# EAGLE schematic I2C_Shield (EAGLE 7.7.0)
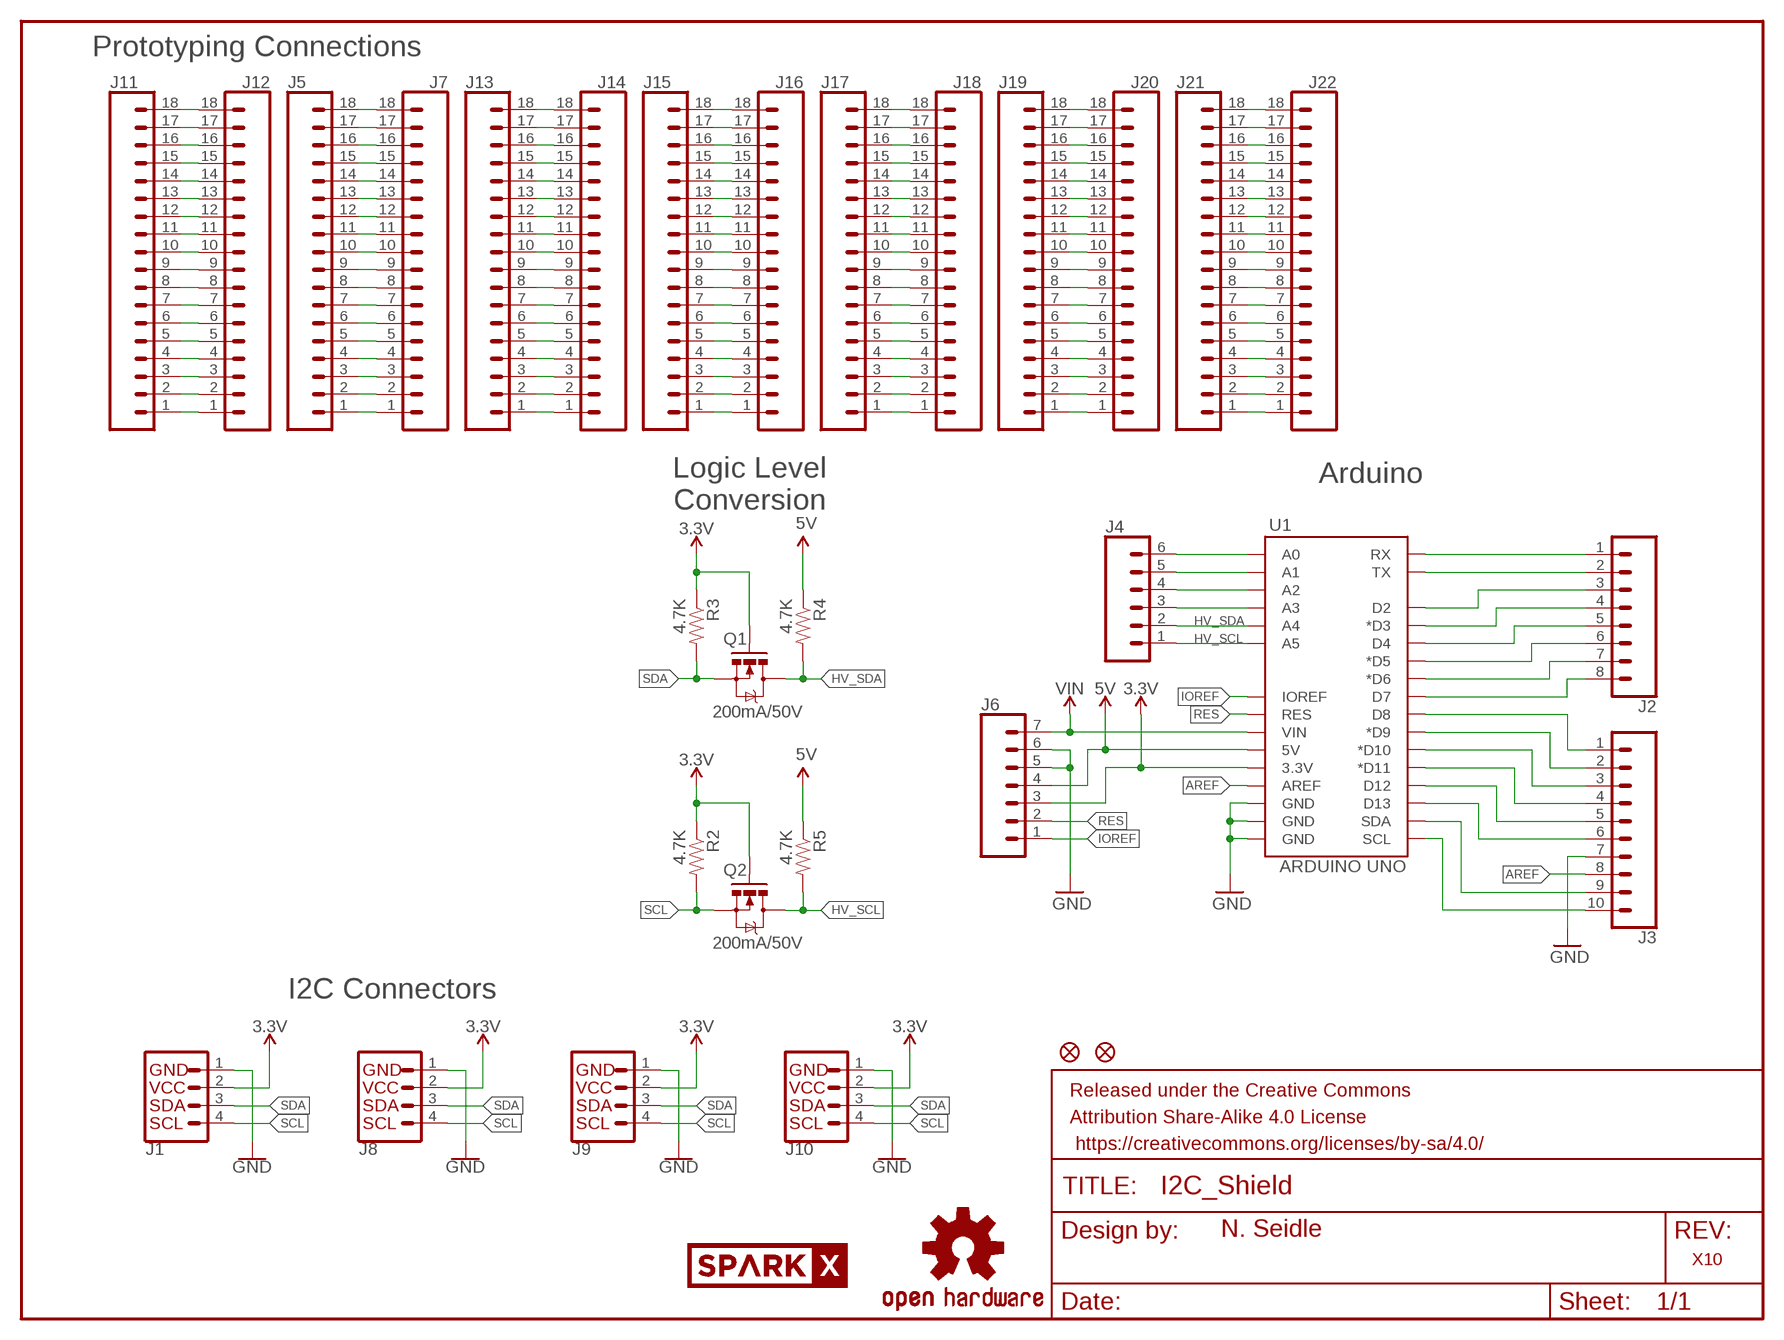
[diagram p0: schematic, sheet 1]

## Parts
FD1  FIDUCIAL1X2  [FIDUCIAL-1X2]
FD2  FIDUCIAL1X2  [FIDUCIAL-1X2]
FRAME1  FRAME-LETTER  [CREATIVE_COMMONS]
J1  I2C_STANDARDJS-1MM  [1X04_1MM_RA]
J2  CONN_08NO_SILK_FEMALE_PTH  [1X08_NO_SILK]
J3  CONN_10NO_SILK_PTH_FEMALE  [1X10_NO_SILK]
J4  CONN_06NO_SILK_FEMALE_PTH  [1X06_NO_SILK]
J5  CONN_18NO_SILK  [1X18_NO_SILK]
J6  CONN_07NO_SILK  [1X07_NO_SILK]
J7  CONN_18NO_SILK  [1X18_NO_SILK]
J8  I2C_STANDARDJS-1MM  [1X04_1MM_RA]
J9  I2C_STANDARDJS-1MM  [1X04_1MM_RA]
J10  I2C_STANDARDJS-1MM  [1X04_1MM_RA]
J11  CONN_18NO_SILK  [1X18_NO_SILK]
J12  CONN_18NO_SILK  [1X18_NO_SILK]
J13  CONN_18NO_SILK  [1X18_NO_SILK]
J14  CONN_18NO_SILK  [1X18_NO_SILK]
J15  CONN_18NO_SILK  [1X18_NO_SILK]
J16  CONN_18NO_SILK  [1X18_NO_SILK]
J17  CONN_18NO_SILK  [1X18_NO_SILK]
J18  CONN_18NO_SILK  [1X18_NO_SILK]
J19  CONN_18NO_SILK  [1X18_NO_SILK]
J20  CONN_18NO_SILK  [1X18_NO_SILK]
J21  CONN_18NO_SILK  [1X18_NO_SILK]
J22  CONN_18NO_SILK  [1X18_NO_SILK]
LOGO1  OSHW-LOGOMINI  [OSHW-LOGO-MINI]
Q1  200mA/50V  MOSFET-NCHANNELBSS138  [SOT23-3]
Q2  200mA/50V  MOSFET-NCHANNELBSS138  [SOT23-3]
R2  4.7K  4.7KOHM-1/10W-1%(0603)  [0603-RES]
R3  4.7K  4.7KOHM-1/10W-1%(0603)  [0603-RES]
R4  4.7K  4.7KOHM-1/10W-1%(0603)  [0603-RES]
R5  4.7K  4.7KOHM-1/10W-1%(0603)  [0603-RES]
U1  ARDUINO UNO  ARDUINO_R3_SHIELDNOLABELS  [UNO_R3_SHIELD_NOLABELS]
U$1  SPARKX-LOGO3  [SPARKX-SMALL]
U$2  SPARKX-LOGO5  [SPARKX-LARGE]

## Nets
3.3V: J1.2(VCC) J6.3 J8.2(VCC) J9.2(VCC) J10.2(VCC) Q1.1(G) Q2.1(G) R2.1 R3.1 U1.3.3V
5V: J6.4 R4.1 R5.1 U1.5V
A0: J4.6 U1.A0
A1: J4.5 U1.A1
A2: J4.4 U1.A2
A3: J4.3 U1.A3
AREF: J3.8 U1.AREF
D2: J2.3 U1.D2
D3: J2.4 U1.D3(*D3)
D4: J2.5 U1.D4
D5: J2.6 U1.D5(*D5)
D6: J2.7 U1.D6(*D6)
D7: J2.8 U1.D7
D8: J3.1 U1.D8
D9: J3.2 U1.D9(*D9)
D10: J3.3 U1.D10(*D10)
D11: J3.4 U1.D11(*D11)
D12: J3.5 U1.D12
D13: J3.6 U1.D13
GND [vcc]: J1.1(GND) J3.7 J6.5 J6.6 J8.1(GND) J9.1(GND) J10.1(GND) U1.GND@0(GND) U1.GND@1(GND) U1.GND@2(GND)
HV_SCL: J4.1 Q2.3(D) R5.2 U1.A5
HV_SDA: J4.2 Q1.3(D) R4.2 U1.A4
IOREF: J6.1 U1.IOREF
N$1: J5.2 J7.2
N$2: J5.3 J7.3
N$3: J5.4 J7.4
N$4: J5.5 J7.5
N$5: J5.6 J7.6
N$6: J5.7 J7.7
N$7: J5.8 J7.8
N$8: J5.9 J7.9
N$9: J5.10 J7.10
N$10: J5.11 J7.11
N$11: J5.12 J7.12
N$12: J5.13 J7.13
N$13: J5.14 J7.14
N$14: J5.15 J7.15
N$15: J5.16 J7.16
N$16: J5.17 J7.17
N$17: J5.18 J7.18
N$18: J5.1 J7.1
N$19: J13.2 J14.2
N$20: J13.3 J14.3
N$21: J11.2 J12.2
N$22: J11.3 J12.3
N$23: J11.4 J12.4
N$24: J11.5 J12.5
N$25: J11.6 J12.6
N$26: J11.7 J12.7
N$27: J11.8 J12.8
N$28: J11.9 J12.9
N$29: J11.10 J12.10
N$30: J11.11 J12.11
N$31: J11.12 J12.12
N$32: J11.13 J12.13
N$33: J11.14 J12.14
N$34: J11.15 J12.15
N$35: J11.16 J12.16
N$36: J11.17 J12.17
N$37: J11.18 J12.18
N$38: J11.1 J12.1
N$39: J13.4 J14.4
N$40: J13.5 J14.5
N$41: J13.6 J14.6
N$42: J13.7 J14.7
N$43: J13.8 J14.8
N$44: J13.9 J14.9
N$45: J13.10 J14.10
N$46: J13.11 J14.11
N$47: J13.12 J14.12
N$48: J13.13 J14.13
N$49: J13.14 J14.14
N$50: J13.15 J14.15
N$51: J13.16 J14.16
N$52: J13.17 J14.17
N$53: J13.18 J14.18
N$54: J13.1 J14.1
N$55: J15.2 J16.2
N$56: J15.3 J16.3
N$57: J15.4 J16.4
N$58: J15.5 J16.5
N$59: J15.6 J16.6
N$60: J15.7 J16.7
N$61: J15.8 J16.8
N$62: J15.9 J16.9
N$63: J15.10 J16.10
N$64: J15.11 J16.11
N$65: J15.12 J16.12
N$66: J15.13 J16.13
N$67: J15.14 J16.14
N$68: J15.15 J16.15
N$69: J15.16 J16.16
N$70: J15.17 J16.17
N$71: J15.18 J16.18
N$72: J15.1 J16.1
N$73: J17.2 J18.2
N$74: J17.3 J18.3
N$75: J17.4 J18.4
N$76: J17.5 J18.5
N$77: J17.6 J18.6
N$78: J17.7 J18.7
N$79: J17.8 J18.8
N$80: J17.9 J18.9
N$81: J17.10 J18.10
N$82: J17.11 J18.11
N$83: J17.12 J18.12
N$84: J17.13 J18.13
N$85: J17.14 J18.14
N$86: J17.15 J18.15
N$87: J17.16 J18.16
N$88: J17.17 J18.17
N$89: J17.18 J18.18
N$90: J17.1 J18.1
N$91: J19.2 J20.2
N$92: J19.3 J20.3
N$93: J19.4 J20.4
N$94: J19.5 J20.5
N$95: J19.6 J20.6
N$96: J19.7 J20.7
N$97: J19.8 J20.8
N$98: J19.9 J20.9
N$99: J19.10 J20.10
N$100: J19.11 J20.11
N$101: J19.12 J20.12
N$102: J19.13 J20.13
N$103: J19.14 J20.14
N$104: J19.15 J20.15
N$105: J19.16 J20.16
N$106: J19.17 J20.17
N$107: J19.18 J20.18
N$108: J19.1 J20.1
N$109: J21.2 J22.2
N$110: J21.3 J22.3
N$111: J21.4 J22.4
N$112: J21.5 J22.5
N$113: J21.6 J22.6
N$114: J21.7 J22.7
N$115: J21.8 J22.8
N$116: J21.9 J22.9
N$117: J21.10 J22.10
N$118: J21.11 J22.11
N$119: J21.12 J22.12
N$120: J21.13 J22.13
N$121: J21.14 J22.14
N$122: J21.15 J22.15
N$123: J21.16 J22.16
N$124: J21.17 J22.17
N$125: J21.18 J22.18
N$126: J21.1 J22.1
RES: J6.2 U1.RES
RX: J2.1 U1.RX
SCL: J1.4(SCL) J8.4(SCL) J9.4(SCL) J10.4(SCL) Q2.2(S) R2.2
SCL1: J3.10 U1.SCL
SDA: J1.3(SDA) J8.3(SDA) J9.3(SDA) J10.3(SDA) Q1.2(S) R3.2
SDA1: J3.9 U1.SDA
TX: J2.2 U1.TX
VIN [vcc]: J6.7 U1.VIN

## Notes on the sheet
- Prototyping Connections
- Logic Level
  Conversion
- Arduino
- I2C Connectors
- N. Seidle
- X10

## Library data of the parts
FD1 FD2 = SparkFun-Aesthetics:FIDUCIAL: Fiducial Alignment Points Various fiducial points for machine vision alignment.
FRAME1 = SparkFun-Aesthetics:FRAME-LETTER: Schematic Frame Standard 8.5x11 US Letter frame
J1 J8-J10 = SparkX:I2C_STANDARD: SparkFun I2C Standard Pinout Header SparkFun has standardized on a pinout for all I2C based sensor breakouts. This pinout allows I2C boards to be plugged directly into the headers on Arduino Uno compatible boards, and to be daisy chained easily. Example SparkFun Products: SparkFun Atmospheric Sensor Breakout - BME280 <https://www.sparkfun.com/products/13676> SparkFun Altitude/Pressure Sensor Breakout - MPL3115A2 <https://www.sparkfun.com/products/11084> SparkFun TOF Range Finder Sensor - VL6180 <https://www.sparkfun.com/products/12785>
J2 = SparkFun-Connectors:CONN_08: Multi connection point. Often used as Generic Header-pin footprint for 0.1 inch spaced/style header connections On any of the 0.1 inch spaced packages, you can populate with these: Break Away Headers - Straight <https://www.sparkfun.com/products/116> (PRT-00116) Break Away Male Headers - Right Angle <https://www.sparkfun.com/products/553> (PRT-00553) Female Headers <https://www.sparkfun.com/products/115> (PRT-00115) Break Away Headers - Machine Pin <https://www.sparkfun.com/products/117> (PRT-00117) Break Away Female Headers - Swiss Machine Pin <https://www.sparkfun.com/products/743> (PRT-00743) Arduino Stackable Header - 8 Pin <https://www.sparkfun.com/products/9279> (PRT-09279) For SCREWTERMINALS and SPRING TERMINALS visit here: Screw Terimnals on SparkFun.com <https://www.sparkfun.com/search/results?term=Screw+Terminals> (5mm/3.5mm/2.54mm spacing) This device is also useful as a general connection point to wire up your design to another part of your project. Our various solder wires solder well into these plated through hole pads. Hook-Up Wire - Assortment (Stranded, 22 AWG) <https://www.sparkfun.com/products/11375> (PRT-11375) Hook-Up Wire - Assortment (Solid Core, 22 AWG) <https://www.sparkfun.com/products/11367> (PRT-11367) View the entire wire category on our website here <https://www.sparkfun.com/categories/141> Special notes: Molex polarized connector foot print use with SKU : PRT-08231 with associated crimp pins and housings. 1MM SMD Version SKU: PRT-10208 NOTES ON THE VARIANTS LOCK and LOCK_LONGPADS... This footprint was designed to help hold the alignment of a through-hole component (i.e. 6-pin header) while soldering it into place. You may notice that each hole has been shifted either up or down by 0.005 of an inch from it's more standard position (which is a perfectly straight line). This slight alteration caused the pins (the squares in the middle) to touch the edges of the holes. Because they are alternating, it causes a "brace" to hold the component in place. 0.005 has proven to be the perfect amount of "off-center" position when using our standard breakaway headers. Although looks a little odd when you look at the bare footprint, once you have a header in there, the alteration is very hard to notice. Also,if you push a header all the way into place, it is covered up entirely on the bottom side.; PROD_ID: CONN-08438
J3 = SparkFun-Connectors:CONN_10: Multi connection point. Often used as Generic Header-pin footprint for 0.1 inch spaced/style header connections On any of the 0.1 inch spaced packages, you can populate with these: Break Away Headers - Straight <https://www.sparkfun.com/products/116> (PRT-00116) Break Away Male Headers - Right Angle <https://www.sparkfun.com/products/553> (PRT-00553) Female Headers <https://www.sparkfun.com/products/115> (PRT-00115) Break Away Headers - Machine Pin <https://www.sparkfun.com/products/117> (PRT-00117) Break Away Female Headers - Swiss Machine Pin <https://www.sparkfun.com/products/743> (PRT-00743) Arduino Stackable Header - 10 Pin <https://www.sparkfun.com/products/11376> (PRT-11376) For SCREWTERMINALS and SPRING TERMINALS visit here: Screw Terimnals on SparkFun.com <https://www.sparkfun.com/search/results?term=Screw+Terminals> (5mm/3.5mm/2.54mm spacing) This device is also useful as a general connection point to wire up your design to another part of your project. Our various solder wires solder well into these plated through hole pads. Hook-Up Wire - Assortment (Stranded, 22 AWG) <https://www.sparkfun.com/products/11375> (PRT-11375) Hook-Up Wire - Assortment (Solid Core, 22 AWG) <https://www.sparkfun.com/products/11367> (PRT-11367) View the entire wire category on our website here <https://www.sparkfun.com/categories/141> Special notes: Molex polarized connector foot print use with SKU : PRT-08231 with associated crimp pins and housings. 1MM SMD Version SKU: PRT-10208 NOTES ON THE VARIANTS LOCK and LOCK_LONGPADS... This footprint was designed to help hold the alignment of a through-hole component (i.e. 6-pin header) while soldering it into place. You may notice that each hole has been shifted either up or down by 0.005 of an inch from it's more standard position (which is a perfectly straight line). This slight alteration caused the pins (the squares in the middle) to touch the edges of the holes. Because they are alternating, it causes a "brace" to hold the component in place. 0.005 has proven to be the perfect amount of "off-center" position when using our standard breakaway headers. Although looks a little odd when you look at the bare footprint, once you have a header in there, the alteration is very hard to notice. Also,if you push a header all the way into place, it is covered up entirely on the bottom side.; PROD_ID: CONN-11563
J4 = SparkFun-Connectors:CONN_06: Multi connection point. Often used as Generic Header-pin footprint for 0.1 inch spaced/style header connections On any of the 0.1 inch spaced packages, you can populate with these: Break Away Headers - Straight <https://www.sparkfun.com/products/116> (PRT-00116) Break Away Male Headers - Right Angle <https://www.sparkfun.com/products/553> (PRT-00553) Female Headers <https://www.sparkfun.com/products/115> (PRT-00115) Break Away Headers - Machine Pin <https://www.sparkfun.com/products/117> (PRT-00117) Break Away Female Headers - Swiss Machine Pin <https://www.sparkfun.com/products/743> (PRT-00743) Arduino Stackable Header - 6 Pin <https://www.sparkfun.com/products/9280> (PRT-09280) For SCREWTERMINALS and SPRING TERMINALS visit here: Screw Terimnals on SparkFun.com <https://www.sparkfun.com/search/results?term=Screw+Terminals> (5mm/3.5mm/2.54mm spacing) This device is also useful as a general connection point to wire up your design to another part of your project. Our various solder wires solder well into these plated through hole pads. Hook-Up Wire - Assortment (Stranded, 22 AWG) <https://www.sparkfun.com/products/11375> (PRT-11375) Hook-Up Wire - Assortment (Solid Core, 22 AWG) <https://www.sparkfun.com/products/11367> (PRT-11367) View the entire wire category on our website here <https://www.sparkfun.com/categories/141>; PROD_ID: CONN-08437
J5 J7 J11-J22 = SparkX:CONN_18: Multi connection point. Often used as Generic Header-pin footprint for 0.1 inch spaced/style header connections On any of the 0.1 inch spaced packages, you can populate with these: Break Away Headers - Straight <https://www.sparkfun.com/products/116> (PRT-00116) Break Away Male Headers - Right Angle <https://www.sparkfun.com/products/553> (PRT-00553) Female Headers <https://www.sparkfun.com/products/115> (PRT-00115) Break Away Headers - Machine Pin <https://www.sparkfun.com/products/117> (PRT-00117) Break Away Female Headers - Swiss Machine Pin <https://www.sparkfun.com/products/743> (PRT-00743) For SCREWTERMINALS and SPRING TERMINALS visit here: Screw Terimnals on SparkFun.com <https://www.sparkfun.com/search/results?term=Screw+Terminals> (5mm/3.5mm/2.54mm spacing) This device is also useful as a general connection point to wire up your design to another part of your project. Our various solder wires solder well into these plated through hole pads. Hook-Up Wire - Assortment (Stranded, 22 AWG) <https://www.sparkfun.com/products/11375> (PRT-11375) Hook-Up Wire - Assortment (Solid Core, 22 AWG) <https://www.sparkfun.com/products/11367> (PRT-11367) View the entire wire category on our website here <https://www.sparkfun.com/categories/141> Special notes: Molex polarized connector foot print use with SKU : PRT-08231 with associated crimp pins and housings. 1MM SMD Version SKU: PRT-10208 NOTES ON THE VARIANTS LOCK and LOCK_LONGPADS... This footprint was designed to help hold the alignment of a through-hole component (i.e. 6-pin header) while soldering it into place. You may notice that each hole has been shifted either up or down by 0.005 of an inch from it's more standard position (which is a perfectly straight line). This slight alteration caused the pins (the squares in the middle) to touch the edges of the holes. Because they are alternating, it causes a "brace" to hold the component in place. 0.005 has proven to be the perfect amount of "off-center" position when using our standard breakaway headers. Although looks a little odd when you look at the bare footprint, once you have a header in there, the alteration is very hard to notice. Also,if you push a header all the way into place, it is covered up entirely on the bottom side.
J6 = SparkFun-Connectors:CONN_07: Multi connection point. Often used as Generic Header-pin footprint for 0.1 inch spaced/style header connections On any of the 0.1 inch spaced packages, you can populate with these: Break Away Headers - Straight <https://www.sparkfun.com/products/116> (PRT-00116) Break Away Male Headers - Right Angle <https://www.sparkfun.com/products/553> (PRT-00553) Female Headers <https://www.sparkfun.com/products/115> (PRT-00115) Break Away Headers - Machine Pin <https://www.sparkfun.com/products/117> (PRT-00117) Break Away Female Headers - Swiss Machine Pin <https://www.sparkfun.com/products/743> (PRT-00743) For SCREWTERMINALS and SPRING TERMINALS visit here: Screw Terimnals on SparkFun.com <https://www.sparkfun.com/search/results?term=Screw+Terminals> (5mm/3.5mm/2.54mm spacing) This device is also useful as a general connection point to wire up your design to another part of your project. Our various solder wires solder well into these plated through hole pads. Hook-Up Wire - Assortment (Stranded, 22 AWG) <https://www.sparkfun.com/products/11375> (PRT-11375) Hook-Up Wire - Assortment (Solid Core, 22 AWG) <https://www.sparkfun.com/products/11367> (PRT-11367) View the entire wire category on our website here <https://www.sparkfun.com/categories/141> Special notes: Molex polarized connector foot print use with SKU : PRT-08231 with associated crimp pins and housings. 1MM SMD Version SKU: PRT-10208 NOTES ON THE VARIANTS LOCK and LOCK_LONGPADS... This footprint was designed to help hold the alignment of a through-hole component (i.e. 6-pin header) while soldering it into place. You may notice that each hole has been shifted either up or down by 0.005 of an inch from it's more standard position (which is a perfectly straight line). This slight alteration caused the pins (the squares in the middle) to touch the edges of the holes. Because they are alternating, it causes a "brace" to hold the component in place. 0.005 has proven to be the perfect amount of "off-center" position when using our standard breakaway headers. Although looks a little odd when you look at the bare footprint, once you have a header in there, the alteration is very hard to notice. Also,if you push a header all the way into place, it is covered up entirely on the bottom side.
LOGO1 = SparkFun-Aesthetics:OSHW-LOGO: Open Source Hardware Logo This logo indicates the piece of hardware it is found on incorporates a OSHW license and/or adheres to the definition of open source hardware found here: http://freedomdefined.org/OSHW
Q1 Q2 = SparkFun-DiscreteSemi:MOSFET-NCHANNEL: Common NMOSFET Parts MFG P/N Store ID Prod ID FDD8780 TRANS-09984 SI7820DN TRANS-11055 FDS6630A IC-08089 2N7002PW TRANS-11151 FQP30N06L COM-10213 TRANS-10060 BSS123LT1G TRANS-08345 BSS138 TRANS-00830 BS170 2N7000; PROD_ID: TRANS-00830
R2-R5 = SparkFun-Resistors:4.7KOHM-1/10W-1%(0603): RES-07857; PROD_ID: RES-07857
U1 = SparkFun-Boards:ARDUINO_R3_SHIELD: Shield form compatible with the Arduino Uno R3.
U$1 U$2 = SparkX:SPARKX-LOGO

## Net classes
0 Default: width 0.203 mm
1 vcc: width 0.203 mm